# Altium schematic sheet AnchorUWB.SchDoc
size A4; SheetNumber: 1; SheetTotal: 1
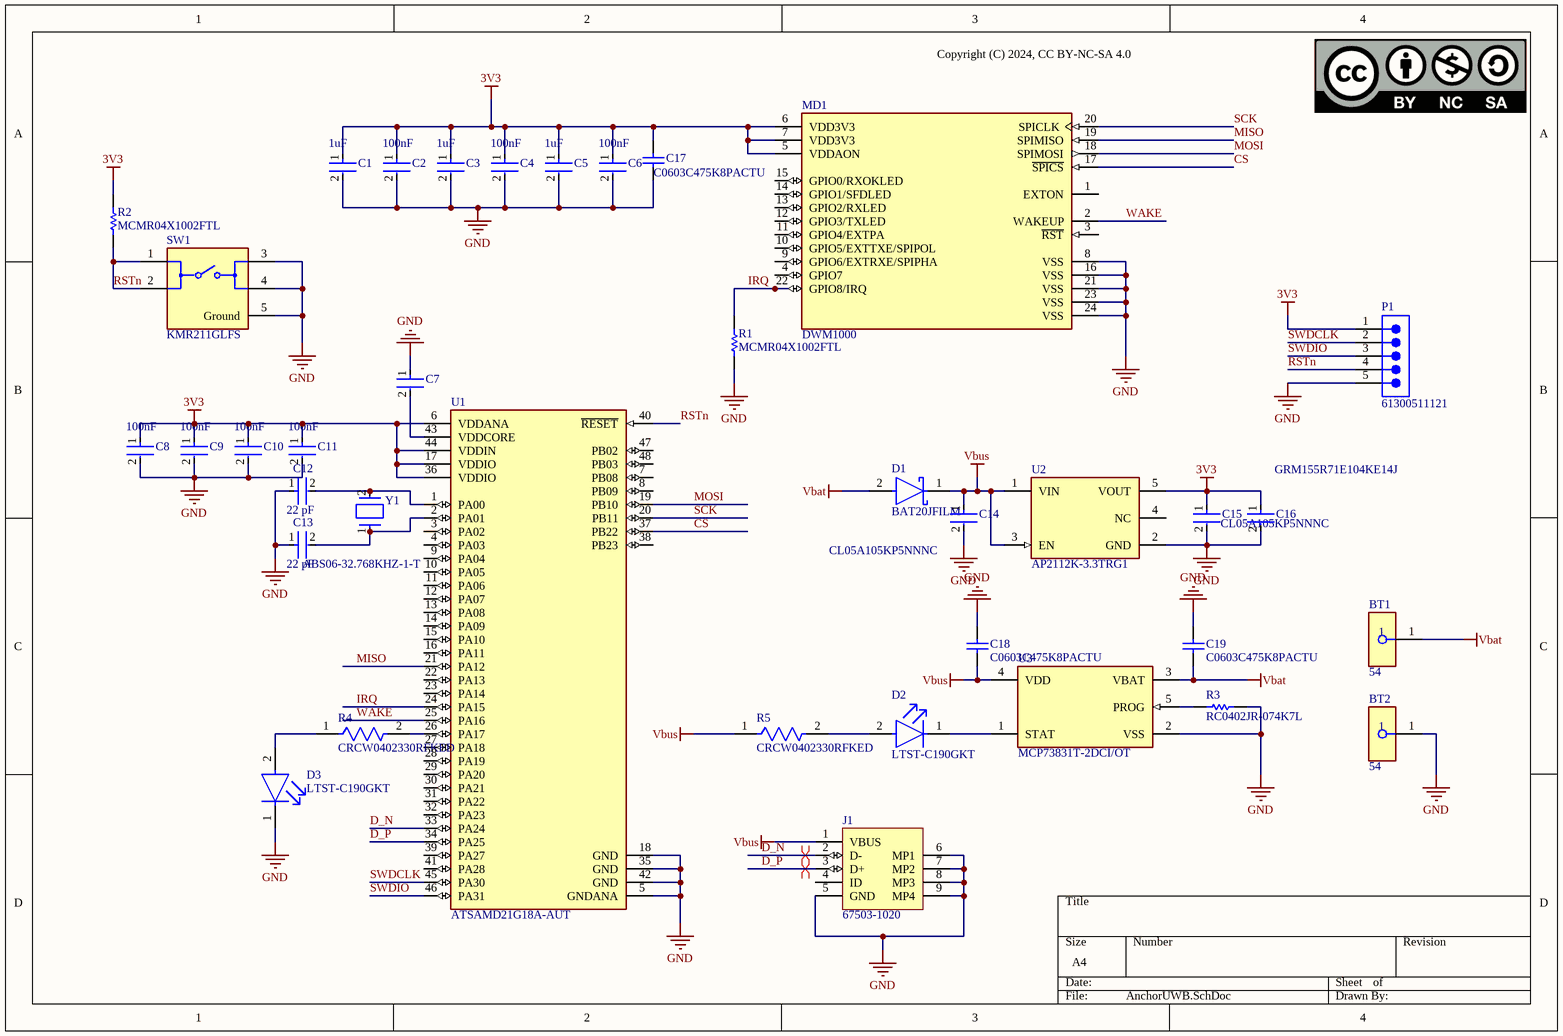
[diagram p0: AnchorUWB.SchDoc]

## Parts
BT1  54  [FP-54-MFG]
BT2  54  [FP-54-MFG]
C1  Capacitance: 1uF  [FP-CL511-IPC_C]  (hidden comment: CL05A105KP5NNNC)
C2  Capacitance: 100nF  [FP-GRM155-0_05-IPC_C]  (hidden comment: GRM155R71E104KE14J)
C3  Capacitance: 1uF  [FP-CL511-IPC_C]  (hidden comment: CL05A105KP5NNNC)
C4  Capacitance: 100nF  [FP-GRM155-0_05-IPC_C]  (hidden comment: GRM155R71E104KE14J)
C5  Capacitance: 1uF  [FP-CL511-IPC_C]  (hidden comment: CL05A105KP5NNNC)
C6  Capacitance: 100nF  [FP-GRM155-0_05-IPC_C]  (hidden comment: GRM155R71E104KE14J)
C7  CL05A105KP5NNNC  [FP-CL511-IPC_C]  (value not drawn)
C8  Capacitance: 100nF  [FP-GRM155-0_05-IPC_C]  (hidden comment: GRM155R71E104KE14J)
C9  Capacitance: 100nF  [FP-GRM155-0_05-IPC_C]  (hidden comment: GRM155R71E104KE14J)
C10  Capacitance: 100nF  [FP-GRM155-0_05-IPC_C]  (hidden comment: GRM155R71E104KE14J)
C11  Capacitance: 100nF  [FP-GRM155-0_05-IPC_C]  (hidden comment: GRM155R71E104KE14J)
C12  Capacitance: 22 pF  [FP-C0402-BB-MFG]  (hidden comment: C0402C220K5GACTU)
C13  Capacitance: 22 pF  [FP-C0402-BB-MFG]  (hidden comment: C0402C220K5GACTU)
C14  CL05A105KP5NNNC  [FP-CL511-IPC_C]
C15  CL05A105KP5NNNC  [FP-CL511-IPC_C]
C16  GRM155R71E104KE14J  [FP-GRM155-0_05-IPC_C]
C17  C0603C475K8PACTU  [CAPC1608X87X35NL15T15]
C18  C0603C475K8PACTU  [CAPC1608X87X35NL15T15]
C19  C0603C475K8PACTU  [CAPC1608X87X35NL15T15]
D1  BAT20JFILM  [FP-BAT20JFILM-MFG]
D2  LTST-C190GKT  [FP-LTST-C190GKT-MFG]
D3  LTST-C190GKT  [FP-LTST-C190GKT-MFG]
J1  67503-1020  [MOLX-67503-1020_V]
MD1  DWM1000  [FP-DWM1000-MFG]
P1  61300511121  [61300511121]
R1  MCMR04X1002FTL  [RESC1005X40X25NL05T10]
R2  MCMR04X1002FTL  [RESC1005X40X25NL05T10]
R3  RC0402JR-074K7L  [RESC1005X40X25LL05T10]
R4  CRCW0402330RFKED  [FP-CRCW0402-e3-MFG]
R5  CRCW0402330RFKED  [FP-CRCW0402-e3-MFG]
SW1  KMR211GLFS  [FP-KMR211GLFS-MFG]
U1  ATSAMD21G18A-AUT  [FP-MC-MFG]
U2  AP2112K-3.3TRG1  [FP-SOT25-IPC_A]
U3  MCP73831T-2DCI/OT  [FP-C04-091-OT-IPC_B]
Y1  ABS06-32.768KHZ-1-T  [FP-ABS06-MFG]

## Nets
3V3: C1.1 C2.1 C3.1 C4.1 C5.1 C6.1 C8.1 C9.1 C10.1 C11.1 C15.1 C16.1 C17.2 MD1.5(VDDAON) MD1.6(VDD3V3) MD1.7(VDD3V3) P1.1 R2.2 U1.6(VDDANA) U1.17(VDDIO) U1.36(VDDIO) U1.44(VDDIN) U2.5(VOUT)
GND: BT2.1 C1.2 C2.2 C3.2 C4.2 C5.2 C6.2 C7.1 C8.2 C9.2 C10.2 C11.2 C12.1 C13.1 C14.2 C15.2 C16.2 C17.1 C18.2 C19.2 D3.1(C) J1.5(GND) J1.6(MP1) J1.7(MP2) J1.8(MP3) J1.9(MP4) MD1.8(VSS) MD1.16(VSS) MD1.21(VSS) MD1.23(VSS) MD1.24(VSS) P1.5 R1.1 R3.2 SW1.3 SW1.4 SW1.5(Ground) U1.5(GNDANA) U1.18(GND) U1.35(GND) U1.42(GND) U2.2(GND) U3.2(VSS)
Vbat: BT1.1 C19.1 D1.2(A) U3.3(VBAT)
Vbus: C14.1 C18.1 D1.1(K) J1.1(VBUS) R5.1 U2.1(VIN) U2.3(EN) U3.4(VDD)
CS: MD1.17(~{SPICS}) U1.37(PB22)
D_N: J1.2(D-) U1.33(PA24)
D_P: J1.3(D+) U1.34(PA25)
IRQ: MD1.22(GPIO8/IRQ) R1.2 U1.24(PA15)
MISO: MD1.19(SPIMISO) U1.21(PA12)
MOSI: MD1.18(SPIMOSI) U1.19(PB10)
RSTn: P1.4 R2.1 SW1.1 SW1.2 U1.40(~{RESET})
SCK: MD1.20(SPICLK) U1.20(PB11)
SWDCLK: P1.2 U1.45(PA30)
SWDIO: P1.3 U1.46(PA31)
WAKE: MD1.2(WAKEUP) U1.25(PA16)
NetC7_2: C7.2 U1.43(VDDCORE)
NetC12_2: C12.2 U1.1(PA00) Y1.2
NetC13_2: C13.2 U1.2(PA01) Y1.1
NetD2_1: D2.1(C) U3.1(STAT)
NetD2_2: D2.2(A) R5.2
NetD3_2: D3.2(A) R4.1
NetR3_1: R3.1 U3.5(PROG)
NetR4_2: R4.2 U1.26(PA17)

Not connected (* = marked no-connect by the designer): J1 4(ID); MD1 1(EXTON) 3(~{RST}) 4(GPIO7) 9(GPIO6/EXTRXE/SPIPHA) 10(GPIO5/EXTTXE/SPIPOL) 11(GPIO4/EXTPA) 12(GPIO3/TXLED) 13(GPIO2/RXLED) 14(GPIO1/SFDLED) 15(GPIO0/RXOKLED); U1 3(PA02) 4(PA03) 7(PB08) 8(PB09) 9(PA04) 10(PA05) 11(PA06) 12(PA07) 13(PA08) 14(PA09) 15(PA10) 16(PA11) 22(PA13) 23(PA14) 27(PA18) 28(PA19) 29(PA20) 30(PA21) 31(PA22) 32(PA23) 38(PB23) 39(PA27) 41(PA28) 47(PB02) 48(PB03); U2 4(NC)

## Layout directives
differential pair: D_N, D_P

## Notes on the sheet
- (near MD1) Copyright (C) 2024, CC BY-NC-SA 4.0

## Library data of the parts
BT1 BT2 = CMP-19636-000013-1: BATTERY CONTACT CLP 18650 PC PIN; Lead Free: Lead Free
C1 C3 C5 C7 C14 C15 = CMP-13271-001936-1: Cap Ceramic 1uF 10V X5R ±10% SMD 0402 +85°C Paper T/R; Depth: 0.5mm; Case Code (Imperial): 0402; Material: Ceramic; Mount: Surface Mount; Thickness: 0.022inch; Dielectric: X5R; Radiation Hardening: No; Case/Package: 0402; Length: 1mm; Tolerance: 10%; Max Operating Temperature: 85°C; Package Quantity: 1; Width: 0.02inch; Voltage Rating: 10V; Contact Plating: Tin; Height: 0.5mm; Min Operating Temperature: -55°C; Case Code (Metric): 1005; Packaging: Tape and Reel
  C7 C14 C15: Capacitance: 1uF
C2 C4 C6 C8-C11 = CMP-06035-003995-1: Chip Multilayer Ceramic Capacitors for General Purpose, 0402, 0.10uF, X7R, 15%, 10%, 25V; Resistor Type: Ceramic; Tolerance: 10%; Case Code (Metric): 1005; Termination: SMD/SMT; Mount: Surface Mount; Voltage Rating: 25V; Voltage Rating (DC): 25V; Case Code (Imperial): 0402; Max Operating Temperature: 125°C; Weight: 0.000212oz; Case/Package: 0402; Length: 0.039inch; Width: 0.5mm; Thickness: 0.022inch; Height: 0.5mm; Packaging: Tape and Reel; Package Quantity: 50000; Min Operating Temperature: -55°C; Dielectric: X7R
C12 C13 = CMP-2008-03341-2: CAP CER 22PF 50V 10% NP0 0402; Manufacturer: Kemet; Tolerance: 0.1; Material: Ceramic; Temperature Characteristic: C0G; Temperature Coefficient: 15%; ComponentLink2URL: https://content.kemet.com/datasheets/KEM_C1002_X7R_SMD.pdf; Automotive: No; Octopart: https://octopart.com/c0402c220k5gactu-kemet-9144192; Mouser Description: Multilayer Ceramic Capacitors MLCC - SMD/SMT 50volts 22pF C0G 10%; Device Class L2: Capacitors; Device Class L1: Passive Components; Device Class L3: Ceramic Capacitors; Voltage Rating: 50 V; Package: C0402-BB; RoHS: TRUE; Value: 22 pF; Temperature: -55°C to +125°C; Category: Cap; ComponentLink2Description: Datasheet; Digikey Description: CAP CER 22PF 50V 10% NP0 0402; Ipc Land Pattern Name: CAPC10050X50; Temperature Range Low: -55°C; Manufacturer Part Number: C0402C220K5GACTU; Temperature Range High: +125°C; Lead Free: Yes; Height: 0.55mm
C16 = CMP-06035-003995-1: Chip Multilayer Ceramic Capacitors for General Purpose, 0402, 0.10uF, X7R, 15%, 10%, 25V; Capacitance: 100nF; Resistor Type: Ceramic; Tolerance: 10%; Case Code (Metric): 1005; Termination: SMD/SMT; Mount: Surface Mount; Voltage Rating: 25V; Voltage Rating (DC): 25V; Case Code (Imperial): 0402; Max Operating Temperature: 125°C; Weight: 0.000212oz; Case/Package: 0402; Length: 0.039inch; Width: 0.5mm; Thickness: 0.022inch; Height: 0.5mm; Packaging: Tape and Reel; Package Quantity: 50000; Min Operating Temperature: -55°C; Dielectric: X7R
C17-C19 = CMP-2006-03238-1: Manufacturer: Kemet; Part Number: C0603C475K8PACTU
D1 = CMP-12187-000030-1: DIODE SCHOTTKY 23V 1A SOD323; Polarity: Standard; Element Configuration: Single; Capacitance: 30pF; Forward Voltage: 620mV; Max Surge Current: 5A; Peak Reverse Current: 12uA; Packaging: Tape and Reel; Weight: 0.01lb; Output Current: 1A; Lead Free: Lead Free; Forward Current: 1A; Mount: Surface Mount; Max Reverse Voltage (DC): 23V; Average Rectified Current: 1A; Max Operating Temperature: 150°C; Max Forward Surge Current (Ifsm): 5A; REACH SVHC: No SVHC; Current Rating: 1A; Length: 1.8mm; Radiation Hardening: No; Max Reverse Leakage Current: 12uA; Voltage Rating (DC): 23V; Height: 1.03mm; Peak Non-Repetitive Surge Current: 5A; Max Repetitive Reverse Voltage (Vrrm): 23V; Min Operating Temperature: -65°C; Number of Pins: 2; Width: 1.35mm; Package Quantity: 1
D2 D3 = CMP-22017-000005-2: LED GREEN CLEAR CHIP SMD; Dominant Wavelength: 569nm; Reverse Voltage: 5V; Lens Color: Colorless; Viewing Angle: 130°; Voltage: 2V; Forward Current: 30mA; Power Dissipation: 100mW; Luminous Intensity: 6mcd; Number of LEDs: 1; Forward Voltage: 2.1V; Wavelength: 565nm; Test Current: 10mA; Min Operating Temperature: -55°C; Lens Style: Clear; Mount: Surface Mount; Width: 0.8mm; Packaging: Tape and Reel; Lens Transparency: Clear; Case Code (Metric): 1608; Depth: 0.8mm; Case Code (Imperial): 0603; Case/Package: 0603; Number of Pins: 2; Max Operating Temperature: 85°C; Lead Free: Lead Free; Number of Elements: 1; Length: 1.6mm; Height: 0.8mm; Package Quantity: 1; Power Rating: 100mW; Radiation Hardening: No; Illumination Color: Green; Color: Green
J1 = CMP-0411-00002-1: USB, MINI, SMD, RA KME04-USBMU03A01; Manufacturer: Molex; ComponentLink1URL: http://www.molex.com/; PartNumber: 67503-1020; Mounting Technology: Surface Mount; ComponentLink1Description: Manufacturer URL; Terminal Pitch: 0.8 mm; DatasheetVersion: Rev F, 06/2009; ComponentLink2Description: Datasheet; PackageDescription: Mini USB Connector, SMT, Righer Angle; ComponentLink2URL: http://www.molex.com/pdm_docs/sd/675031020_sd.pdf; PackageReference: 67503-1020
MD1 = CMP-231853-000001-1: RX TXRX MODULE 802.15.4 CHIP SMD
P1 = CMP-1502-01068-2: NexarPartId: 32855526; Operating Supply Voltage: 250V; Number of Contacts: 5; Connector Type: Male Pin; Current Rating: 3A; Contact Resistance: 20mΩ; Pitch: 2.54mm; Gender: Male; Termination: Solder; RoHS: Compliant; Lead Pitch: 2.54mm; Contact Mating Length: 5.9944mm; Number of Positions: 5; Lead Free: Lead Free; Contact Plating: Gold; Number of Pins: 5; Min Operating Temperature: -40°C; Voltage Rating: 250V; Color: Black; Mount: Through Hole; REACH SVHC: Unknown; Packaging: Bulk; Height: 8.89mm; Number of Rows: 1; Orientation: Vertical; Contact Material: Copper; Max Operating Temperature: 105°C
R1 R2 = CMP-2002-06479-1: Manufacturer: Multicomp; Part Number: MCMR04X1002FTL
R3 = CMP-2002-08011-1: Manufacturer: Yageo / Phycomp; Part Number: RC0402JR-074K7L
R4 R5 = CMP-2002-08523-2: RES Thick Film, 330Ω, 1%, 0.063W, 100ppm/°C, 0402; Max Power Dissipation: 63mW; Voltage Rating (DC): 50V; Resistance: 330R; Case/Package: 0402; Packaging: Tape and Reel; Width: 0.5mm; Case Code (Metric): 1005; Radiation Hardening: No; Military Standard: Not; Contact Plating: Tin; Temperature Coefficient: 100ppm/°C; Lead Free: Lead Free; Power Rating: 63mW; Voltage Rating: 50V; Tolerance: 1%; Features: Automotive AEC-Q200; Case Code (Imperial): 0402; Composition: Thick Film; Weight: 2.3E-05oz; Package Quantity: 10; Min Operating Temperature: -55°C; Height: 0.35mm; Length: 1mm; Termination: SMD/SMT; Number of Terminations: 2; Depth: 0.5mm; Max Operating Temperature: 155°C
SW1 = CMP-10040-000023-1: SWITCH TACTILE SPST-NO 0.05A 32V; Switch Function: Off-Mom; Throw Configuration: SPST; Switch Travel: 0.2mm; Current Rating: 50mA; Illumination Type: Non-Illuminated; Actuator Length: 0.5mm; Power Rating: 1W; Operating Force: 1.2N; Actuator Type: Standard; Mechanical Life: 200000Cycles; REACH SVHC: No SVHC; Voltage Rating (DC): 32V; Length: 2.8mm; Min Operating Temperature: -40°C; Mount: Surface Mount; Max Voltage Rating (DC): 32V; Width: 2.8mm; Depth: 4.6mm; Packaging: Tape and Reel; Lead Free: Lead Free; Contact Material: Silver; Termination: Gull Wing; Package Quantity: 1; Contact Current Rating: 50mA; Orientation: Straight; Max Operating Temperature: 85°C; Radiation Hardening: No; Max Current Rating: 50mA; Contact Plating: Silver
U1 = CMP-06276-000066-1: IC MCU 32BIT 256KB FLASH 48TQFP; Peripherals: Brown-out Detect/Reset; Oscillator Type: Internal; Core Architecture: ARM; Interface: I2C; Number of I/Os: 38; Frequency: 48MHz; Packaging: Cut Tape; Case/Package: TQFP; Number of Pins: 48; Max Operating Temperature: 85°C; Memory Type: FLASH; Memory Size: 256KB; Min Operating Temperature: -40°C
U2 = CMP-12756-000035-1: IC REG LINEAR 3.3V 600MA SOT25; Number of Regulators: 1; Output Type: Fixed; Polarity: Positive; Min Input Voltage: 2.5V; Max Input Voltage: 6V; Accuracy: 1.5%; Quiescent Current: 55uA; Dropout Voltage: 250mV; Min Operating Temperature: -40°C; Length: 3.1mm; Output Current: 600mA; Max Operating Temperature: 85°C; Package Quantity: 1; Output Voltage: 3.3V; Width: 1.7mm; Number of Outputs: 1; Packaging: Tape and Reel; Height: 1.3mm; Lead Free: Lead Free; Max Output Current: 600mA; Case/Package: SOT-23-5; Mount: Surface Mount; Number of Pins: 5
U3 = CMP-0133-00146-2: IC CONTROLLR LI-ION 4.2V SOT23-5; Max Charge Current: 500mA; Min Output Voltage: 4.168V; Max Supply Voltage: 6V; Max Output Voltage: 4.232V; Number of Cells: 1; Operating Supply Current: 510uA; Min Supply Voltage: 3.75V; Max Output Current: 500mA; Case/Package: SOT-23; Radiation Hardening: No; REACH SVHC: No SVHC; Package Quantity: 3000; Output Current: 500mA; Number of Channels: 1; Output Voltage: 4.2V; Max Operating Temperature: 85°C; Number of Pins: 5; Mount: Surface Mount; Length: 3.1mm; Contact Plating: Tin; Packaging: Tape and Reel; Width: 1.8mm; Min Operating Temperature: -40°C; Max Input Voltage: 3.75V; Height: 1.3mm; Lead Free: Lead Free
Y1 = CMP-27762-012387-2: CRYSTAL 32.7680KHZ 12.5PF SMD; Series Resistance: 90kR; Frequency Tolerance: 10ppm; Number of Pins: 2; Max Operating Temperature: 85°C; Load Capacitance: 12.5pF; Series: ABS06; Depth: 1.2mm; Height: 0.6mm; Min Operating Temperature: -40°C; Mount: Surface Mount; Lead Free: Lead Free; Width: 1.2mm; Frequency: 32.768kHz; ESR (Equivalent Series Resistance): 90kR; Termination: SMD/SMT; Packaging: Tape and Reel; RoHS Compliant: Yes; REACH SVHC: No SVHC; Operating Frequency: 32.768 kHz; Case/Package: CSMD; Package Quantity: 3000; Radiation Hardening: No; Tolerance: 10ppm; Length: 2mm